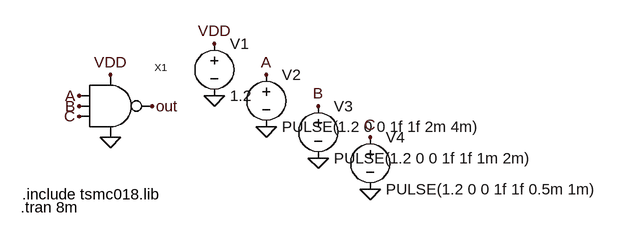
[diagram p0: schematic tb_3to1NAND_x1.asc]
tb_3to1NAND_x1.asc, the LTspice schematic file:
Version 4
SHEET 1 944 680
FLAG 160 208 0
FLAG 160 112 VDD
FLAG 224 160 out
FLAG 112 144 A
FLAG 112 160 B
FLAG 112 176 C
FLAG 320 144 0
FLAG 400 192 0
FLAG 480 240 0
FLAG 560 288 0
FLAG 320 64 VDD
FLAG 400 112 A
FLAG 480 160 B
FLAG 560 208 C
SYMBOL 3to1NAND_x1 144 176 R0
SYMATTR InstName X1
SYMBOL voltage 320 48 R0
WINDOW 123 0 0 Left 0
WINDOW 39 0 0 Left 0
SYMATTR InstName V1
SYMATTR Value 1.2
SYMBOL voltage 400 96 R0
WINDOW 123 0 0 Left 0
WINDOW 39 0 0 Left 0
SYMATTR InstName V2
SYMATTR Value PULSE(1.2 0 0 1f 1f 2m 4m)
SYMBOL voltage 480 144 R0
WINDOW 123 0 0 Left 0
WINDOW 39 0 0 Left 0
SYMATTR InstName V3
SYMATTR Value PULSE(1.2 0 0 1f 1f 1m 2m)
SYMBOL voltage 560 192 R0
WINDOW 123 0 0 Left 0
WINDOW 39 0 0 Left 0
SYMATTR InstName V4
SYMATTR Value PULSE(1.2 0 0 1f 1f 0.5m 1m)
TEXT 24 296 Left 2 !.include tsmc018.lib
TEXT 22 316 Left 2 !.tran 8m

The netlist it stands for:
* tb_3to1NAND_x1.asc
XX1 A B C VDD 0 out 3to1NAND_x1  ; pins A B C VDD VSS OUT
V1 VDD 0 1.2
V2 A 0 PULSE(1.2 0 0 1f 1f 2m 4m)
V3 B 0 PULSE(1.2 0 0 1f 1f 1m 2m)
V4 C 0 PULSE(1.2 0 0 1f 1f 0.5m 1m)
.include tsmc018.lib
.tran 8m
.backanno
.end